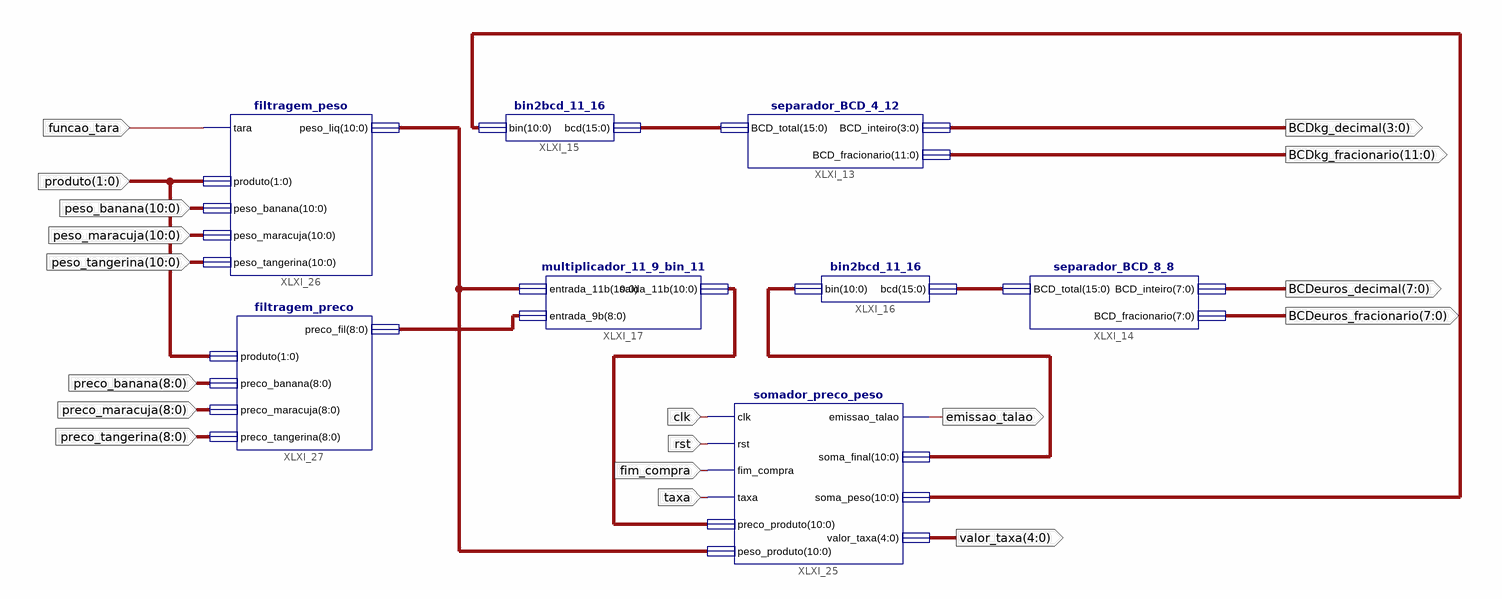
[diagram p0: schematic sheet 1]
// Xilinx ISE schematic esquema.sch (artix7) as structural Verilog: 8 symbols, 18 ports
module esquema (
  input  funcao_tara,
  input  clk,
  input  rst,
  input  fim_compra,
  input  taxa,
  input  [1:0] produto,
  input  [10:0] peso_banana,
  input  [8:0] preco_banana,
  input  [8:0] preco_maracuja,
  input  [10:0] peso_maracuja,
  input  [10:0] peso_tangerina,
  input  [8:0] preco_tangerina,
  output [3:0] BCDkg_decimal,
  output [11:0] BCDkg_fracionario,
  output [7:0] BCDeuros_decimal,
  output [7:0] BCDeuros_fracionario,
  output emissao_talao,
  output [4:0] valor_taxa
);

  wire [8:0] XLXN_20;
  wire [10:0] XLXN_61, XLXN_76, XLXN_79, XLXN_84;
  wire [15:0] calculo_euros, peso_kg;

  separador_BCD_4_12 XLXI_13 (.BCD_total(peso_kg), .BCD_inteiro(BCDkg_decimal), .BCD_fracionario(BCDkg_fracionario));
  separador_BCD_8_8 XLXI_14 (
    .BCD_total(calculo_euros), .BCD_inteiro(BCDeuros_decimal), .BCD_fracionario(BCDeuros_fracionario));
  bin2bcd_11_16 XLXI_15 (.bin(XLXN_79), .bcd(peso_kg));
  bin2bcd_11_16 XLXI_16 (.bin(XLXN_76), .bcd(calculo_euros));
  multiplicador_11_9_bin_11 XLXI_17 (.entrada_11b(XLXN_84), .entrada_9b(XLXN_20), .saida_11b(XLXN_61));
  somador_preco_peso XLXI_25 (
    .clk(clk), .rst(rst), .fim_compra(fim_compra), .taxa(taxa), .preco_produto(XLXN_61),
    .peso_produto(XLXN_84), .emissao_talao(emissao_talao), .soma_final(XLXN_76), .soma_peso(XLXN_79),
    .valor_taxa(valor_taxa));
  filtragem_peso XLXI_26 (
    .tara(funcao_tara), .peso_liq(XLXN_84), .produto(produto), .peso_banana(peso_banana),
    .peso_maracuja(peso_maracuja), .peso_tangerina(peso_tangerina));
  filtragem_preco XLXI_27 (
    .preco_fil(XLXN_20), .produto(produto), .preco_banana(preco_banana), .preco_maracuja(preco_maracuja),
    .preco_tangerina(preco_tangerina));
endmodule
